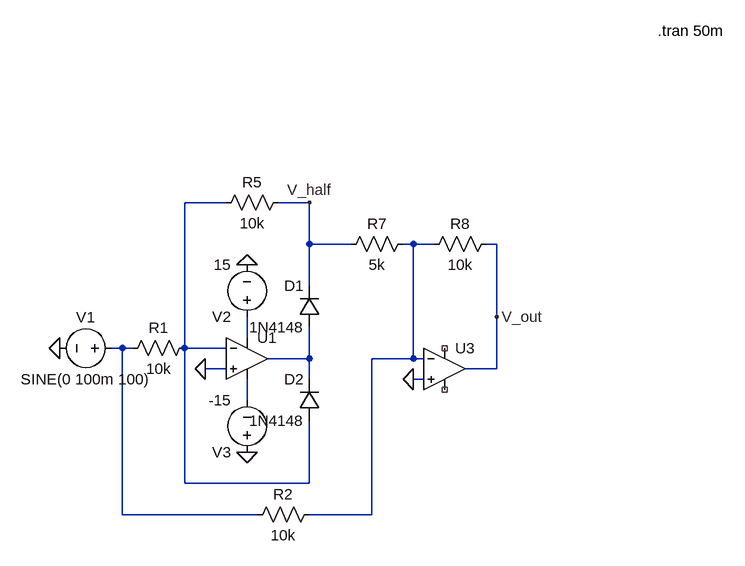
[diagram p0: schematic Draft2.asc]
Draft2.asc, the LTspice schematic file:
Version 4.1
SHEET 1 880 736
WIRE 64 208 0 208
WIRE 192 208 144 208
WIRE 192 272 192 208
WIRE 256 272 192 272
WIRE 352 272 336 272
WIRE 384 272 352 272
WIRE 480 272 464 272
WIRE 192 336 192 272
WIRE 480 384 480 272
WIRE 96 416 96 384
WIRE -96 432 -112 432
WIRE -80 432 -96 432
WIRE 0 432 0 208
WIRE 64 432 0 432
WIRE 192 448 192 400
WIRE 192 448 128 448
WIRE 352 448 352 272
WIRE 352 448 288 448
WIRE 368 448 352 448
WIRE 64 464 32 464
WIRE 480 464 480 384
WIRE 480 464 432 464
WIRE 192 480 192 448
WIRE 368 480 352 480
WIRE 96 512 96 480
WIRE 0 640 0 432
WIRE 192 640 192 544
WIRE 192 640 0 640
WIRE -96 688 -96 432
WIRE 112 688 -96 688
WIRE 288 688 288 448
WIRE 288 688 192 688
FLAG 96 304 0
FLAG 96 592 0
FLAG 192 208 V_half
FLAG 480 384 V_out
FLAG 32 464 0
FLAG -192 432 0
FLAG 352 480 0
SYMBOL diode 208 400 R180
WINDOW 0 24 64 Left 2
WINDOW 3 24 0 Left 2
SYMATTR InstName D1
SYMATTR Value 1N4148
SYMBOL res -96 448 R270
WINDOW 0 32 56 VTop 2
WINDOW 3 0 56 VBottom 2
SYMATTR InstName R1
SYMATTR Value 10k
SYMBOL res 160 192 R90
WINDOW 0 0 56 VBottom 2
WINDOW 3 32 56 VTop 2
SYMATTR InstName R5
SYMATTR Value 10k
SYMBOL voltage -96 432 R90
WINDOW 0 -32 56 VBottom 2
WINDOW 3 32 56 VTop 2
WINDOW 123 0 0 Left 0
WINDOW 39 0 0 Left 0
SYMATTR InstName V1
SYMATTR Value SINE(0 100m 100)
SYMBOL voltage 96 400 R180
WINDOW 123 0 0 Left 0
WINDOW 39 0 0 Left 0
SYMATTR InstName V2
SYMATTR Value 15
SYMBOL voltage 96 608 R180
WINDOW 123 0 0 Left 0
WINDOW 39 0 0 Left 0
SYMATTR InstName V3
SYMATTR Value -15
SYMBOL diode 208 544 R180
WINDOW 0 24 64 Left 2
WINDOW 3 24 0 Left 2
SYMATTR InstName D2
SYMATTR Value 1N4148
SYMBOL OpAmps\\UniversalOpAmp 96 448 R0
SYMATTR InstName U1
SYMBOL OpAmps\\UniversalOpAmp 400 464 R0
SYMATTR InstName U3
SYMBOL res 352 256 R90
WINDOW 0 0 56 VBottom 2
WINDOW 3 32 56 VTop 2
SYMATTR InstName R7
SYMATTR Value 5k
SYMBOL res 480 256 R90
WINDOW 0 0 56 VBottom 2
WINDOW 3 32 56 VTop 2
SYMATTR InstName R8
SYMATTR Value 10k
SYMBOL res 96 704 R270
WINDOW 0 32 56 VTop 2
WINDOW 3 0 56 VBottom 2
SYMATTR InstName R2
SYMATTR Value 10k
TEXT 728 -56 Left 2 !.tran 50m

The netlist it stands for:
* Draft2.asc
D1 N005 V_half 1N4148
R1 N004 N001 10k
R5 V_half N001 10k
V1 N004 0 SINE(0 100m 100)
V2 N003 0 15
V3 0 N006 -15
D2 N001 N005 1N4148
X§U1 0 N001 N003 N006 N005 level1 Avol=1Meg GBW=10Meg Vos=0 En=0 Enk=0 In=0 Ink=0 Rin=500Meg  ; pins In+ In- V+ V- OUT
X§U3 0 N002 NC_01 NC_02 V_out level1 Avol=1Meg GBW=10Meg Vos=0 En=0 Enk=0 In=0 Ink=0 Rin=500Meg  ; pins In+ In- V+ V- OUT
R7 N002 V_half 5k
R8 V_out N002 10k
R2 N004 N002 10k
.model D D
.lib standard.dio
.tran 50m
.lib UniversalOpAmp1.lib
.backanno
.end

* Results of the author's LTspice run, read from the files saved beside the schematic
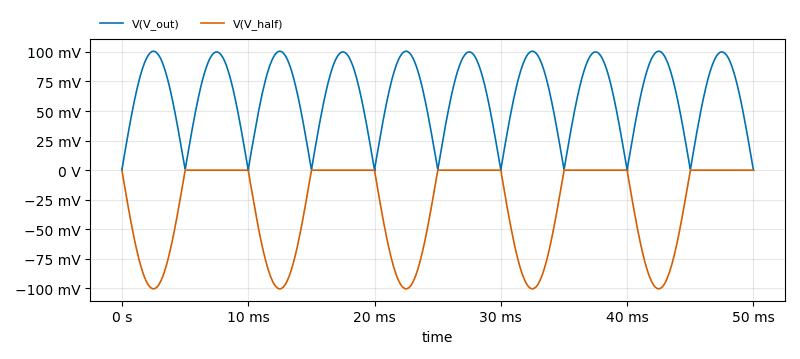
[diagram p1: Transient Analysis of Draft2.asc, plotted from the saved traces]
* Transient Analysis, 1 run:
*   V(V_out): min -684.4 µV, max 100.6 mV, average 63.92 mV, rms 70.95 mV, last 80.84 µV
*   V(V_half): min -100.3 mV, max 142.8 µV, average -31.96 mV, rms 50.17 mV, last -28.62 µV